# Altium schematic sheet Synthesizer.SchDoc
size A4; DocumentNumber: 7; SheetNumber: 7; SheetTotal: 9
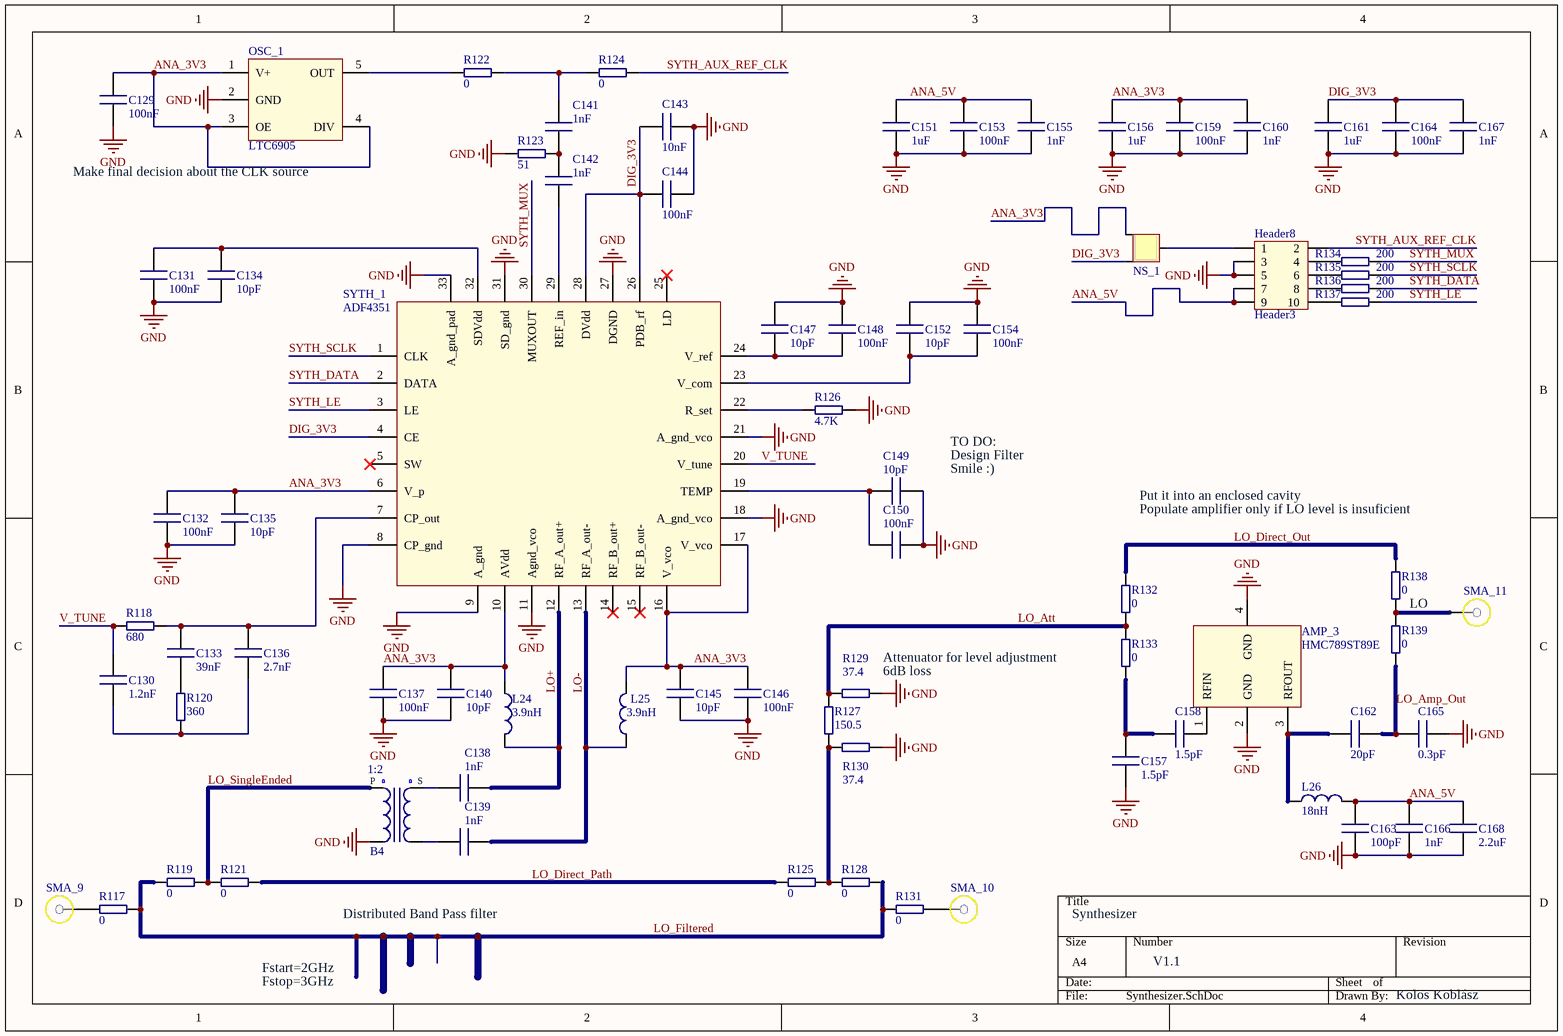
[diagram p0: Synthesizer.SchDoc]

## Parts
AMP_3  HMC789ST89E
B4  ImpedanceTransformation P : S: 1:2  [BALUN_CHIP]  (hidden comment: Balun)
C129  value 100nF  [0805 SMD Passive]  (hidden comment: Cap1)
C130  value 1.2nF  [0805 SMD Passive]  (hidden comment: Cap1)
C131  value 100nF  [0805 SMD Passive]  (hidden comment: Cap1)
C132  value 100nF  [0805 SMD Passive]  (hidden comment: Cap1)
C133  value 39nF  [0805 SMD Passive]  (hidden comment: Cap1)
C134  value 10pF  [0805 SMD Passive]  (hidden comment: Cap1)
C135  value 10pF  [0805 SMD Passive]  (hidden comment: Cap1)
C136  value 2.7nF  [0805 SMD Passive]  (hidden comment: Cap1)
C137  value 100nF  [0805 SMD Passive]  (hidden comment: Cap1)
C138  value 1nF  [0805 SMD Passive]  (hidden comment: Cap1)
C139  value 1nF  [0805 SMD Passive]  (hidden comment: Cap1)
C140  value 10pF  [0805 SMD Passive]  (hidden comment: Cap1)
C141  value 1nF  [0805 SMD Passive]  (hidden comment: Cap1)
C142  value 1nF  [0805 SMD Passive]  (hidden comment: Cap1)
C143  value 10nF  [0805 SMD Passive]  (hidden comment: Cap1)
C144  value 100nF  [0805 SMD Passive]  (hidden comment: Cap1)
C145  value 10pF  [0805 SMD Passive]  (hidden comment: Cap1)
C146  value 100nF  [0805 SMD Passive]  (hidden comment: Cap1)
C147  value 10pF  [0805 SMD Passive]  (hidden comment: Cap1)
C148  value 100nF  [0805 SMD Passive]  (hidden comment: Cap1)
C149  value 10pF  [0805 SMD Passive]  (hidden comment: Cap1)
C150  value 100nF  [0805 SMD Passive]  (hidden comment: Cap1)
C151  value 1uF  [0805 SMD Passive]  (hidden comment: Cap1)
C152  value 10pF  [0805 SMD Passive]  (hidden comment: Cap1)
C153  value 100nF  [0805 SMD Passive]  (hidden comment: Cap1)
C154  value 100nF  [0805 SMD Passive]  (hidden comment: Cap1)
C155  value 1nF  [0805 SMD Passive]  (hidden comment: Cap1)
C156  value 1uF  [0805 SMD Passive]  (hidden comment: Cap1)
C157  value 1.5pF  [0805 SMD Passive]  (hidden comment: Cap1)
C158  value 1.5pF  [0805 SMD Passive]  (hidden comment: Cap1)
C159  value 100nF  [0805 SMD Passive]  (hidden comment: Cap1)
C160  value 1nF  [0805 SMD Passive]  (hidden comment: Cap1)
C161  value 1uF  [0805 SMD Passive]  (hidden comment: Cap1)
C162  value 20pF  [0805 SMD Passive]  (hidden comment: Cap1)
C163  value 100pF  [0805 SMD Passive]  (hidden comment: Cap1)
C164  value 100nF  [0805 SMD Passive]  (hidden comment: Cap1)
C165  value 0.3pF  [0805 SMD Passive]  (hidden comment: Cap1)
C166  value 1nF  [0805 SMD Passive]  (hidden comment: Cap1)
C167  value 1nF  [0805 SMD Passive]  (hidden comment: Cap1)
C168  value 2.2uF  [0805 SMD Passive]  (hidden comment: Cap1)
Header8  Header3  [Header3]
L24  value 3.9nH  [0805 SMD Passive]  (hidden comment: Inductor)
L25  value 3.9nH  [0805 SMD Passive]  (hidden comment: Inductor)
L26  value 18nH  [0805 SMD Passive]  (hidden comment: Inductor)
NS_1  NetSplit  [NetSplit_2]  (value not drawn)
OSC_1  LTC6905
R117  value 0  [0805 SMD Passive]  (hidden comment: Resistor)
R118  value 680  [0805 SMD Passive]  (hidden comment: Resistor)
R119  value 0  [0805 SMD Passive]  (hidden comment: Resistor)
R120  value 360  [0805 SMD Passive]  (hidden comment: Resistor)
R121  value 0  [0805 SMD Passive]  (hidden comment: Resistor)
R122  value 0  [0805 SMD Passive]  (hidden comment: Resistor)
R123  value 51  [0805 SMD Passive]  (hidden comment: Resistor)
R124  value 0  [0805 SMD Passive]  (hidden comment: Resistor)
R125  value 0  [0805 SMD Passive]  (hidden comment: Resistor)
R126  value 4.7K  [0805 SMD Passive]  (hidden comment: Resistor)
R127  value 150.5  [0805 SMD Passive]  (hidden comment: Resistor)
R128  value 0  [0805 SMD Passive]  (hidden comment: Resistor)
R129  value 37.4  [0805 SMD Passive]  (hidden comment: Resistor)
R130  value 37.4  [0805 SMD Passive]  (hidden comment: Resistor)
R131  value 0  [0805 SMD Passive]  (hidden comment: Resistor)
R132  value 0  [0805 SMD Passive]  (hidden comment: Resistor)
R133  value 0  [0805 SMD Passive]  (hidden comment: Resistor)
R134  value 200  [0805 SMD Passive]  (hidden comment: Resistor)
R135  value 200  [0805 SMD Passive]  (hidden comment: Resistor)
R136  value 200  [0805 SMD Passive]  (hidden comment: Resistor)
R137  value 200  [0805 SMD Passive]  (hidden comment: Resistor)
R138  value 0  [0805 SMD Passive]  (hidden comment: Resistor)
R139  value 0  [0805 SMD Passive]  (hidden comment: Resistor)
SMA_9  SMA1  [SMA Flange]  (value not drawn)
SMA_10  SMA1  [SMA Flange]  (value not drawn)
SMA_11  SMA1  [SMA Flange]  (value not drawn)
SYTH_1  ADF4351  [LFCSP-32]

## Nets
GND: AMP_3.2(GND) AMP_3.4(GND) B4.4 C129.2 C131.2 C132.2 C134.2 C135.2 C137.2 C140.2 C143.2 C144.2 C145.2 C146.2 C147.2 C148.2 C149.2 C150.2 C151.1 C152.2 C153.1 C154.2 C155.1 C156.1 C157.1 C159.1 C160.1 C161.1 C163.2 C164.1 C165.2 C166.2 C167.1 C168.2 Header8.3 Header8.5 OSC_1.2(GND) R123.1 R126.2 R129.2 R130.2 SYTH_1.8(CP_gnd) SYTH_1.9(A_gnd) SYTH_1.11(Agnd_vco) SYTH_1.18(A_gnd_vco) SYTH_1.21(A_gnd_vco) SYTH_1.27(DGND) SYTH_1.31(SD_gnd) SYTH_1.33(A_gnd_pad)
ANA_3V3: C129.1 C132.1 C135.1 C137.1 C140.1 C145.1 C146.1 C156.2 C159.2 C160.2 L24.1 L25.2 NS_1.0 OSC_1.1(V+) OSC_1.3(OE) OSC_1.4(DIV) SYTH_1.6(V_p) SYTH_1.10(AVdd) SYTH_1.16(V_vco) SYTH_1.17(V_vco)
ANA_5V: C151.2 C153.2 C155.2 C163.1 C166.1 C168.1 Header8.7 Header8.9 L26.2
DIG_3V3: C143.1 C144.1 C161.2 C164.2 C167.2 NS_1.0 SYTH_1.4(CE) SYTH_1.26(PDB_rf) SYTH_1.28(DVdd)
LO+: C138.2 L24.2 SYTH_1.12(RF_A_out+)
LO-: C139.2 L25.1 SYTH_1.13(RF_A_out-)
LO_Amp_Out: C162.2 C165.1 R139.1
LO_Att: R127.1 R129.1 R132.1 R133.2
LO_Direct_Out: R132.2 R138.2
LO_Direct_Path: R121.2 R125.1
LO_Filtered: R117.2 R119.1 R128.2 R131.1
LO_SingleEnded: B4.2 R119.2 R121.1
SYTH_AUX_REF_CLK: Header8.2 R124.2
SYTH_DATA: R136.1 SYTH_1.2(DATA)
SYTH_LE: R137.1 SYTH_1.3(LE)
SYTH_MUX: R134.1 SYTH_1.30(MUXOUT)
SYTH_SCLK: R135.1 SYTH_1.1(CLK)
V_TUNE: C130.1 R118.2 SYTH_1.20(V_tune)
NetAMP_3_1: AMP_3.1(RFIN) C158.2
NetAMP_3_3: AMP_3.3(RFOUT) C162.1 L26.1
NetB4_1: B4.1 C138.1
NetB4_3: B4.3 C139.1
NetC130_2: C130.2 C136.2 R120.1
NetC131_1: C131.1 C134.1 SYTH_1.32(SDVdd)
NetC133_1: C133.1 C136.1 R118.1 SYTH_1.7(CP_out)
NetC133_2: C133.2 R120.2
NetC141_1: C141.1 R122.2 R124.1
NetC141_2: C141.2 C142.1 R123.2
NetC142_2: C142.2 SYTH_1.29(REF_in)
NetC147_1: C147.1 C148.1 SYTH_1.24(V_ref)
NetC149_1: C149.1 C150.1 SYTH_1.19(TEMP)
NetC152_1: C152.1 C154.1 SYTH_1.23(V_com)
NetC157_2: C157.2 C158.1 R133.1
NetHeader8_1: Header8.1 NS_1.0
NetHeader8_4: Header8.4 R134.2
NetHeader8_6: Header8.6 R135.2
NetHeader8_8: Header8.8 R136.2
NetHeader8_10: Header8.10 R137.2
NetOSC_1_5: OSC_1.5(OUT) R122.1
NetR117_1: R117.1 SMA_9.1
NetR125_2: R125.2 R127.2 R128.1 R130.1
NetR126_1: R126.1 SYTH_1.22(R_set)
NetR131_2: R131.2 SMA_10.1
NetR138_1: R138.1 R139.2 SMA_11.1

Not connected (* = marked no-connect by the designer): SYTH_1 5(SW)* 14(RF_B_out+)* 15(RF_B_out-)* 25(LD)*

## Notes on the sheet
- Make final decision about the CLK source
- TO DO:
- Design Filter
- (near C149) Smile :)
- Populate amplifier only if LO level is insuficient
- Put it into an enclosed cavity
- LO
- Attenuator for level adjustment
- (near R129) 6dB loss
- Distributed Band Pass filter
- Synthesizer
- Fstart=2GHz
- Fstop=3GHz
- V1.1
- Kolos Koblász
- (in symbol Balun4) P; S

## Library data of the parts
AMP_3 = HMC789ST89E: Gain Block MMIC; Manufacturer: Analog Devices; Package Description: SOT89; Order Code: HMC789ST89E; PartNumber: HMC789ST89E
B4 = Balun4: SMD Balun; Manufacturer: TDK; PartNumber: HHM1918A2; MaxFrequency: 2700MHz; MinFrequency: 2300MHz; FootPrint: SMD
C129-C168 = Cap1: SMD Capacitor; Precision: 1%; MaxVolt: 16V; FootPrint: *
Header8 = Header3: 10 pin DIL header; PinNumber: 10; Row: 2; Pitch: 2.54mm; Type: Straight
L24-L26 = Ind1: SMD Inductor; Precision: 10%; MaxCurent: 100mA; FootPrint: SMD
NS_1 = NetSplit: Net Split 2 to 1
OSC_1 = LTC6905: Fixed frequency oscillator; Manufacturer: Analog Devices; Order Code: LTC6905-100; Package Description: 5-Lead Plastic TSOT-23; PartNumber: LTC6905-100
R117-R139 = Res1: SMD Resistor; Precision: 1%; MaxPower: 0.1W; FootPrint: SMD
SMA_9-SMA_11 = SMA1: SMA Female; Shape: 90°; Footprint: *; PartNumber: *; Manufacturer: *; OrderCode: *; Mounting: TroughHole
SYTH_1 = ADF4351: Sythesizer with integrated VCO; Manufacturer: Analog Devices; Order Code: ADF4351-BCPZ; Package Description: 32-Lead Lead Frame Chip Scale Package; PartNumber: ADF4351